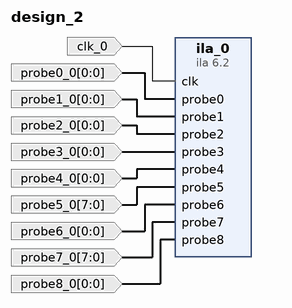
[diagram p0: block diagram of the top level]
# Vivado block design design_2, xc7a35tcpg236-1, Vivado 2024.2
create_bd_design design_2

create_bd_port -dir I -type clk clk_0
create_bd_port -dir I -from 0 -to 0 probe0_0
create_bd_port -dir I -from 0 -to 0 probe1_0
create_bd_port -dir I -from 0 -to 0 probe2_0
create_bd_port -dir I -from 0 -to 0 probe3_0
create_bd_port -dir I -from 0 -to 0 probe4_0
create_bd_port -dir I -from 7 -to 0 probe5_0
create_bd_port -dir I -from 0 -to 0 probe6_0
create_bd_port -dir I -from 7 -to 0 probe7_0
create_bd_port -dir I -from 0 -to 0 probe8_0

create_bd_cell -type ip -vlnv xilinx.com:ip:ila:6.2 ila_0
set_property -dict [list \
  CONFIG.ALL_PROBE_SAME_MU_CNT 2 \
  CONFIG.C_DATA_DEPTH 8192 \
  CONFIG.C_EN_STRG_QUAL 1 \
  CONFIG.C_MONITOR_TYPE Native \
  CONFIG.C_NUM_OF_PROBES 9 \
  CONFIG.C_PROBE0_MU_CNT 2 \
  CONFIG.C_PROBE1_MU_CNT 2 \
  CONFIG.C_PROBE2_MU_CNT 2 \
  CONFIG.C_PROBE3_MU_CNT 2 \
  CONFIG.C_PROBE4_MU_CNT 2 \
  CONFIG.C_PROBE5_MU_CNT 2 \
  CONFIG.C_PROBE5_WIDTH 8 \
  CONFIG.C_PROBE6_MU_CNT 2 \
  CONFIG.C_PROBE7_MU_CNT 2 \
  CONFIG.C_PROBE7_WIDTH 8 \
  CONFIG.C_PROBE8_MU_CNT 2 \
] [get_bd_cells ila_0]

# ---- connections ----

connect_bd_net -net clk_0_1 [get_bd_ports clk_0] [get_bd_pins ila_0/clk]
connect_bd_net -net probe0_0_1 [get_bd_ports probe0_0] [get_bd_pins ila_0/probe0]
connect_bd_net -net probe1_0_1 [get_bd_ports probe1_0] [get_bd_pins ila_0/probe1]
connect_bd_net -net probe2_0_1 [get_bd_ports probe2_0] [get_bd_pins ila_0/probe2]
connect_bd_net -net probe3_0_1 [get_bd_ports probe3_0] [get_bd_pins ila_0/probe3]
connect_bd_net -net probe4_0_1 [get_bd_ports probe4_0] [get_bd_pins ila_0/probe4]
connect_bd_net -net probe5_0_1 [get_bd_ports probe5_0] [get_bd_pins ila_0/probe5]
connect_bd_net -net probe6_0_1 [get_bd_ports probe6_0] [get_bd_pins ila_0/probe6]
connect_bd_net -net probe7_0_1 [get_bd_ports probe7_0] [get_bd_pins ila_0/probe7]
connect_bd_net -net probe8_0_1 [get_bd_ports probe8_0] [get_bd_pins ila_0/probe8]

validate_bd_design
save_bd_design
